# EAGLE design espduino-12-2 (EAGLE 7.2.0)
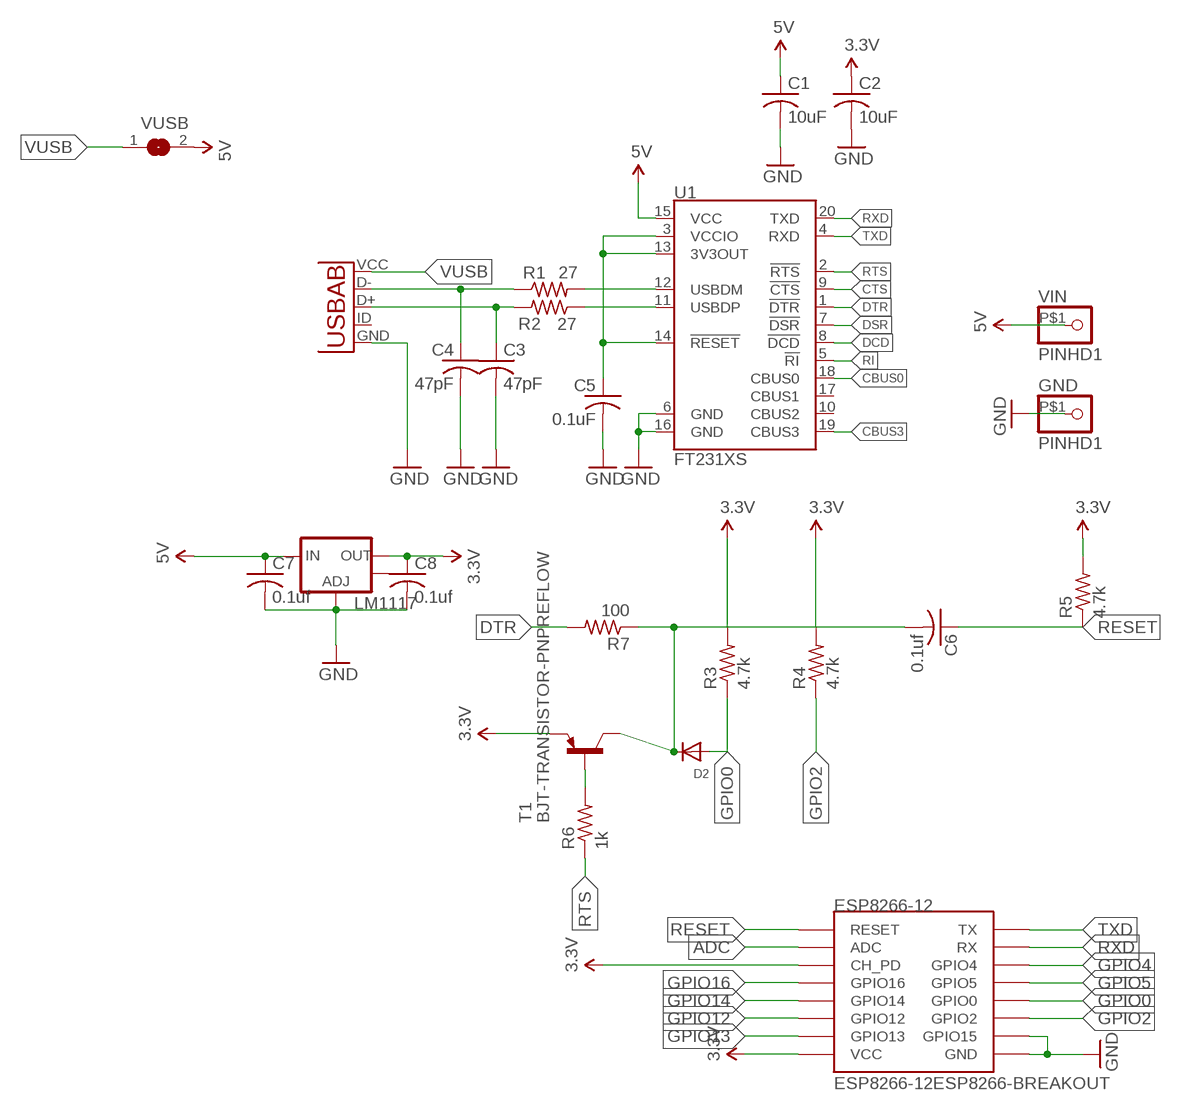
[diagram p0: schematic, sheet 1]

## Parts
C1  10uF  C-USC0603  [C0603]
C2  10uF  C-USC0603  [C0603]
C3  47pF  C-USC0603  [C0603]
C4  47pF  C-USC0603  [C0603]
C5  0.1uF  C-USC0603  [C0603]
C6  0.1uf  C-USC0603  [C0603]
C7  0.1uf  C-USC0603  [C0603]
C8  0.1uf  C-USC0603  [C0603]
D2  DIODESOT23_REFLOW  [SOT23-R]
ESP8266-12  ESP8266-12ESP8266-BREAKOUT  [ESP8266-12-EXT-HEADERS]
GND  PINHD1  [PINHD1]
LM1117  V_REG_LM1117SOT223  [SOT223]
R1  27  R-US_R0603  [R0603]
R2  27  R-US_R0603  [R0603]
R3  4.7k  R-US_R0603  [R0603]
R4  4.7k  R-US_R0603  [R0603]
R5  4.7k  R-US_R0603  [R0603]
R6  1k  R-US_R0603  [R0603]
R7  100  R-US_R0603  [R0603]
T1  BJT-TRANSISTOR-PNPREFLOW  [SOT23-R]
U1  FT231XS  [SSOP20_L]
U2  USB-AB  [MICRO-USB-A01SB141B1]
VIN  PINHD1  [PINHD1]
VUSB  SJCUTTABLE  [SJ-CUTTABLE]

## Nets
3.3V [POWER]: C2.1 C8.1 ESP8266-12.CH_PD ESP8266-12.VCC ESP8266-12.VCC_P(VCC) LM1117.2(OUT) R3.2 R4.2 R5.2 T1.2(E)
5V [POWER]: C1.1 C7.1 LM1117.3(IN) U1.15(VCC) VIN.P$1(GND) VUSB.2
ADC: ESP8266-12.ADC ESP8266-12.ADC_P(ADC)
CBUS0: U1.18(CBUS0)
CBUS3: U1.19(CBUS3)
CTS: U1.9(!CTS)
DCD: U1.8(!DCD)
DSR: U1.7(!DSR)
DTR: R7.2 U1.1(!DTR)
GND [POWER]: C1.2 C2.2 C3.2 C4.2 C5.2 C7.2 C8.2 ESP8266-12.GND ESP8266-12.GND_P(GND) ESP8266-12.GPIO15 GND.P$1(GND) LM1117.1(ADJ) U1.6(GND) U1.16(GND) U2.GND
GPIO0: D2.1(A) ESP8266-12.GPIO0 ESP8266-12.GPIO0_P(GPIO0) R3.1
GPIO2: ESP8266-12.GPIO2 ESP8266-12.GPIO2_P(GPIO2) R4.1
GPIO4: ESP8266-12.GPIO4 ESP8266-12.GPIO4_P(GPIO4)
GPIO5: ESP8266-12.GPIO5 ESP8266-12.GPIO5_P(GPIO5)
GPIO12: ESP8266-12.GPIO12 ESP8266-12.GPIO12_P(GPIO12)
GPIO13: ESP8266-12.GPIO13 ESP8266-12.GPIO13_P(GPIO13)
GPIO14: ESP8266-12.GPIO14 ESP8266-12.GPIO14_P(GPIO14)
GPIO16: ESP8266-12.GPIO16 ESP8266-12.GPIO_16_P(GPIO16)
N$1: R1.2 U1.12(USBDM)
N$2: R2.1 U1.11(USBDP)
N$3: C3.1 R2.2 U2.D+
N$4: C4.1 R1.1 U2.D-
N$5 [POWER]: C5.1 U1.3(VCCIO) U1.13(3V3OUT) U1.14(!RESET)
N$7: R6.2 T1.1(B)
NOT_DTR: C6.2 D2.3(C) R7.1 T1.3(C)
RESET: C6.1 ESP8266-12.RESET ESP8266-12.RST_P(RESET) R5.1
RI: U1.5(!RI)
RTS: R6.1 U1.2(!RTS)
RXD: ESP8266-12.RX ESP8266-12.RX_P(RX) U1.20(TXD)
TXD: ESP8266-12.TX ESP8266-12.TX_P(TX) U1.4(RXD)
VUSB [POWER]: U2.VCC(VBUS) VUSB.1
Unconnected: LM1117.4(OUT) U1.10(CBUS2) U1.17(CBUS1) U2.ID(USBID)

## Library data of the parts
C1-C8 = resistor:C-US: CAPACITOR, American symbol
D2 = adafruit:DIODE: Diode SMADIODE - SMA Surface Mount Package 20V 1A Schottky Diode Digikey: 641-1014-6-ND DO-1N4148 - Through Hole Small Current Diode SOD-123 20V 1 A (.5mV Vf) Schottky Diode - Digikey: MBRX120TPMSCT-ND SOD-323 10V 570mA (.38mV Vf, 3ns) Schottky Diode - Digikey: ZLLS410CT-ND SOD-523 30V 30mA Schottky Diode (RB751S-40TE61) - Digikey: RB751S-40TE61CT-ND SOT23-R/W - SOT23 Package (R = Solder Paste/Reflow Ovens, W = Hand-Soldering) BAT54Film 40V 300mA - Digikey: 497-7162-1-ND
ESP8266-12 = jumper-parts:ESP8266-12: ESP8266 Wifi module 12
GND VIN = jumper-parts:PINHD1
LM1117 = SparkFun-PowerIC:V_REG_LM1117: Voltage Regulator LM1117 Standard adjustable voltage regulator but in SMD form. Spark Fun Electronics SKU : COM-00595; PROD_ID: VREG-08170
R1-R7 = resistor:R-US_: RESISTOR, American symbol
T1 = jumper-parts:BJT-TRANSISTOR-PNP: PNP Darlington Transistor
U1 = SparkFun-DigitalIC:FT231X: FTDI FT231X Full Speed USB to Full-handshake UART This USB2.0 Full Speed IC offers a compact bridge to full handshake UART interfaces. The device is a UART, capable of operating up to 3MBaud, with low power consumption (8mA). The FT231X includes the complete FT-X series feature set and enables USB to be added into a system design quickly and easily over a UART interface.
U2 = jumper-parts:USB-AB: This is a USB AB connector that is compatible with USB OTG. i.e. this connector can serve as a host or device
VUSB = jumper-parts:SJ: SMD solder JUMPER

## Net classes
0 default: width 0.254 mm
1 POWER: width 0.406 mm

## Board
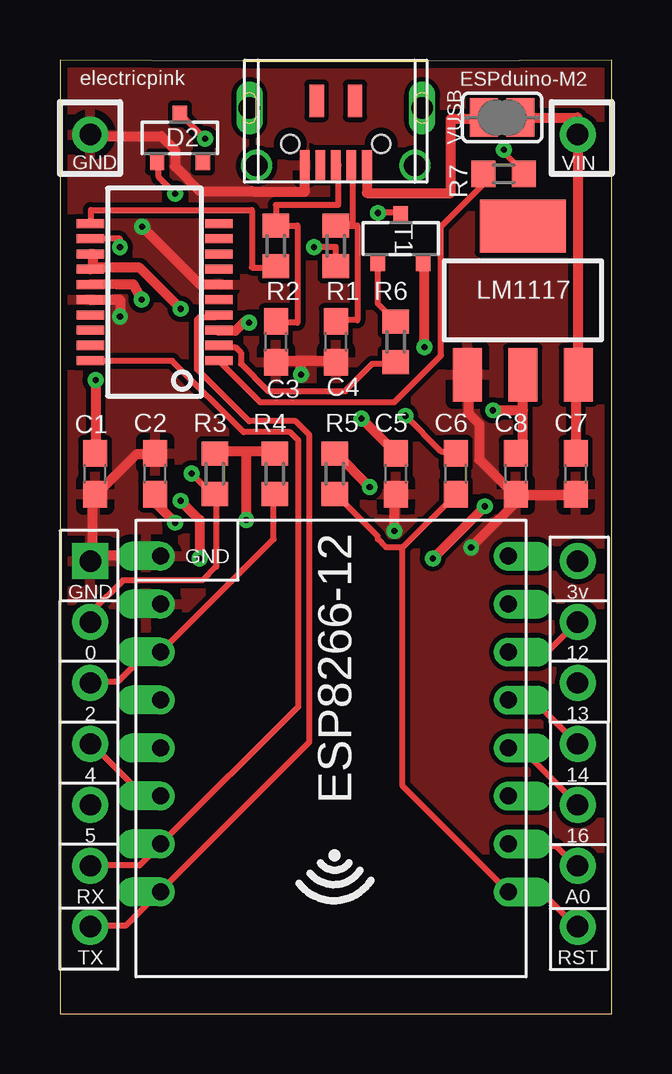
[diagram p1: board, top side]
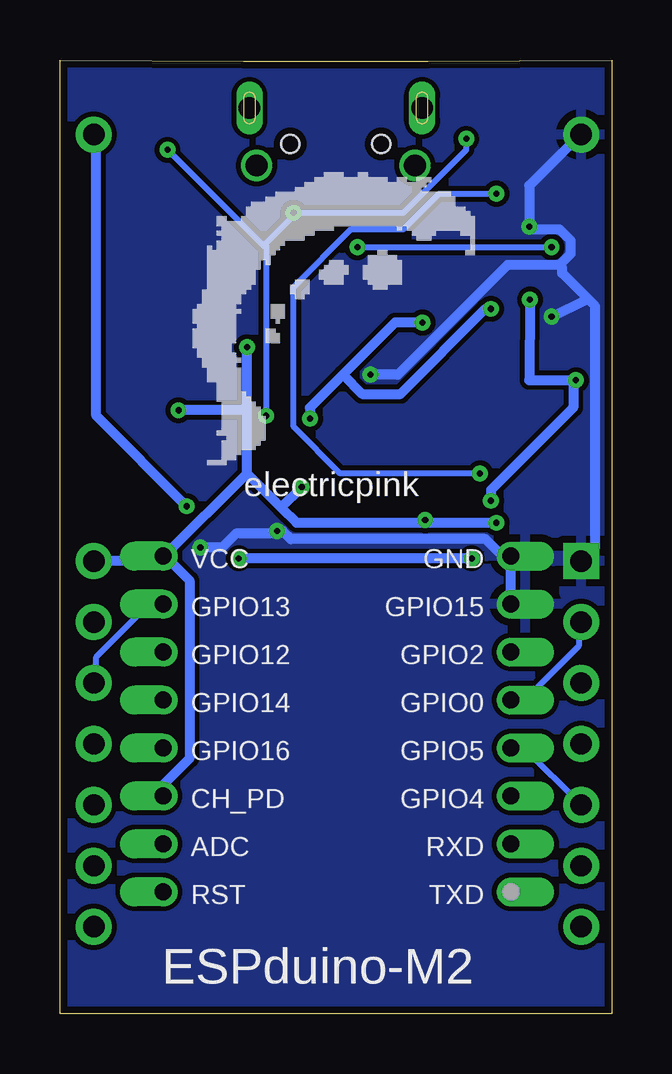
[diagram p2: board, bottom side, seen from below]

Size 23 x 39.75 mm. Coordinates in mm from the lower left corner, seen from the top.
Outline: 0,0 23,0 23,39.75 arc-1 0,39.75 0,0
Copper layers (1*16): Top 0.035mm / dielectric 1.5mm / Bottom 0.035mm
Design rules "SeeedStudio_2layer_conservative *": minimum track width 8mil, minimum drill 10mil, track to track 8mil, track to pad 8mil, pad to pad 8mil, via to via 8mil, smd to smd 0mil, copper to edge 12mil, drill to drill 12mil, minimum pad ring 0mil, minimum via ring 8mil, stop-mask expansion 2mil, vias tented up to drill 100mil, thermal gap 12mil

### Footprints (pad centres in the part's own frame; a part is rotated, then mirrored left to right if it is on the bottom)
C0603 = smd 1.1 x 1: 1 -0.85,0; 2 0.85,0
SOT23-R = smd 0.6 x 0.7: 1 -0.95,-1; 2 0.95,-1; 3 0,1
ESP8266-12-EXT-HEADERS = drill 0.711 pad 1.2 offset: ADC 2.895,11.791; CH_PD 2.895,9.791; GND 17.395,-0.209; GPIO0 17.395,5.791; GPIO2 17.395,3.791; GPIO4 17.395,9.791; GPIO5 17.395,7.791; GPIO12 2.895,3.791; GPIO13 2.895,1.791; GPIO14 2.895,5.791; GPIO15 17.395,1.791; GPIO16 2.895,7.791; RESET 2.895,13.791; RX 17.395,11.791; TX 17.395,13.791; VCC 2.895,-0.209 | drill 0.889 pad 1.5: ADC_P 0,12.7; GPIO0_P 20.32,2.54; GPIO2_P 20.32,5.08; GPIO4_P 20.32,7.62; GPIO5_P 20.32,10.16; GPIO12_P 0,2.54; GPIO13_P 0,5.08; GPIO14_P 0,7.62; GPIO_16_P 0,10.16; RST_P 0,15.24; RX_P 20.32,12.7; TX_P 20.32,15.24; VCC_P 0,0 | drill 0.889 pad 1.5 square: GND_P 20.32,0
PINHD1 = drill 0.889 pad 1.5: P$1 0,0
SOT223 = smd 1.219 x 2.235: 1 -2.311,-3.099; 2 0,-3.099; 3 2.311,-3.099 | smd 3.6 x 2.2: 4 0,3.099
R0603 = smd 1 x 1.1: 1 -0.85,0; 2 0.85,0
SSOP20_L = smd 0.381 x 1.143: 1 -2.857,-2.68; 2 -2.223,-2.68; 3 -1.587,-2.68; 4 -0.953,-2.68; 5 -0.318,-2.68; 6 0.318,-2.68; 7 0.953,-2.68; 8 1.587,-2.68; 9 2.223,-2.68; 10 2.857,-2.68; 11 2.857,2.68; 12 2.223,2.68; 13 1.587,2.68; 14 0.953,2.68; 15 0.318,2.68; 16 -0.318,2.68; 17 -0.953,2.68; 18 -1.587,2.68; 19 -2.223,2.68; 20 -2.857,2.68
MICRO-USB-A01SB141B1 = smd 0.4 x 1.25: D+ 0,-4.375; D- 0.65,-4.375; GND -1.3,-4.375; ID -0.65,-4.375; VCC 1.3,-4.375 | smd 0.6 x 1.35: P$1 -0.8,-1.7; P$2 0.8,-1.7 | drill 0.9 pad 1.3: P$8 -3.3,-4.4; P$9 3.3,-4.4 | drill 0.9 pad 1.1 long: P$10 -3.6,-2; P$12 3.6,-2 | hole 0.75: -1.9,-3.5; 1.9,-3.5
SJ-CUTTABLE = smd 1.168 x 1.6: 1 -0.762,0; 2 0.762,0

### Placement (x,y rotation side)
C1  1.46,22.5 270 top
C2  3.96,22.5 90 top
C3  9,28 270 top
C4  11.5,28 270 top
C5  14,22.5 270 top
C6  16.5,22.5 90 top
C7  21.5,22.5 270 top
C8  19,22.5 270 top
D2  5,36.5 0 top
ESP8266-12  21.59,18.86 180 top
GND  1.27,36.64 0 top
LM1117  19.3,29.73 0 top
R1  11.5,32 270 top
R2  9,32 90 top
R3  6.46,22.5 90 top
R4  8.96,22.5 90 top
R5  11.46,22.5 90 top
R6  14,28 90 top
R7  18.5,35 180 top
T1  14.2,32.3 0 top
U1  3.94,30.07 90 top
U2  11.5,39.75 0 top
U$2  [JUMPER-LOGO-X-SMALL]  12.7,31.3 0 top
VIN  21.59,36.64 0 top
VUSB  18.44,37.35 0 top

### Tracks (layer width: path | path; a pad name or v marks a point on that pad's centre or on a via)
3.3V  (via drill 0.25)
  Top 0.406: C8.1 19.3,23.35 19.3,25.15 | 19.3,25.15 LM1117.2 | 7.77,23.43 8.91,23.43 R4.2 | 7.77,23.43 6.51,23.43 R3.2 | v15.2,27.77 15.2,31.2 T1.2 | v4.8,20.46 4,21.26 4,21.6 C2.1 | v12.92,21.95 11.54,23.32 R5.2 | v7.77,20.57 7.77,23.43 | v18.06,25.15 19.3,25.15
  Bottom 0.406: 15.2,22.52 15.2,25.15 | 15.2,25.15 v15.2,27.77 | 15.2,22.52 18.63,19.09 ESP8266-12.VCC | 7.77,20.46 13.14,20.46 13.77,21.09 | 7.77,20.46 v4.8,20.46 | 15.2,22.52 13.77,21.09 | 13.77,21.09 v12.92,21.95 | v7.77,20.57 7.77,20.46 | ESP8266-12.CH_PD 18.63,9.14 18.63,9.6 17.6,10.63 17.6,18.06 18.52,18.97 ESP8266-12.VCC | ESP8266-12.VCC_P 21.49,18.86 18.97,18.86 18.86,18.97 ESP8266-12.VCC | 15.2,25.15 v18.06,25.15
5V  (via drill 0.25)
  Top 0.406: C7.1 21.5,26.63 LM1117.3 21.6,26.75 21.6,36.46 VIN.P$1 21.59,37.35 VUSB.2 | v1.49,26.4 1.49,23.43 C1.1 | v3.4,29.76 3.06,30.4 2.37,30.4 U1.15 | v15.54,18.97 v17.72,21.14 | v5.83,18.97 5.83,20.57 v5.03,21.37
  Bottom 0.406: v3.4,29.76 3.44,26.4 v1.49,26.4 1.6,26.29 1.6,25.26 5.03,21.83 v5.03,21.37 | v17.72,21.14 21.49,24.92 21.49,36.58 VIN.P$1 | v5.83,18.97 v15.54,18.97
ADC
  Top 0.254: ESP8266-12.ADC 18.75,6.97 20.69,6.97 21.49,6.17 ESP8266-12.ADC_P
DTR
  Top 0.254: R7.2 17.6,34.98 17.6,34.52 15.89,32.8 15.89,27.43 13.95,25.49 8.34,25.49 6.63,27.2 U1.1
GND  (via drill 0.25)
  Top 0.406: U2.GND 10.2,34.25 8.1,34.25 8,34.29 5.83,34.29 4.8,35.32 4.8,36.01 4.23,36.58 1.37,36.58 GND.P$1 | 10.06,27.2 11.43,27.2 C4.2 | 10.06,27.2 9.03,27.2 C3.2 | v3.43,32.8 5.83,30.4 6.51,30.4 U1.6 | v10.06,26.63 10.06,27.2 | C8.2 19.09,21.6 21.49,21.6 C7.2 | C8.2 18.86,21.72 17.49,23.09 17.49,24.57 17.03,25.03 17.03,26.52 LM1117.1 | C2.2 3.89,23.32 3.2,23.32 1.6,21.72 C1.2 1.37,21.6 1.37,18.86 ESP8266-12.GND_P 1.49,19.09 4.12,19.09 ESP8266-12.GND | v13.95,20.12 13.95,21.6 C5.2 | v17.14,19.43 18.97,21.26 18.97,21.49 C8.2 | U1.16 2.5,29.76 v2.5,29.05
  Bottom 0.406: GND.P$1 1.37,36.58 3.43,34.52 v3.43,32.8 3.31,32.69 2.17,32.69 1.71,32.23 1.71,31.66 2.17,31.2 | v10.06,26.63 8.91,26.63 4.34,31.2 2.17,31.2 | ESP8266-12.GPIO15 4.23,17.14 4.23,18.86 ESP8266-12.GND 4.23,19.09 4.57,19.09 5.26,19.77 13.37,19.77 13.72,20.12 v13.95,20.12 14.06,20 15.66,20 16.23,19.43 v17.14,19.43 | 1.1,29.9 0.69,29.49 0.69,19.43 1.26,18.86 ESP8266-12.GND_P | 1.1,29.9 2.06,30.86 2.06,31.09 2.17,31.2 | v2.5,29.05 1.1,29.75 1.1,29.9
  pour Top: 0,0 0,39.5 23,39.5 23,0
  pour Bottom: 0.5,39.5 23,39.5 23,0 0,0 0,39.5
GPIO0  (via drill 0.25)
  Top 0.254: v4.8,34.18 4.12,34.86 4.12,35.43 D2.1 | v5.49,22.52 6.4,21.6 R3.1 6.51,21.6 6.51,18.63 5.94,18.06 2.63,18.06 1.37,16.8 1.37,16.34 ESP8266-12.GPIO0_P
  Bottom 0.254: ESP8266-12.GPIO0 4.12,13.14 3.54,13.14 1.37,15.32 1.37,16.23 ESP8266-12.GPIO0_P | v4.8,34.18 7.2,34.18 8.69,32.69 10.86,32.69 13.26,30.29 13.26,24.46 11.32,22.52 v5.49,22.52
GPIO2
  Top 0.254: R4.1 8.91,21.6 8.91,19.77 4.23,15.09 ESP8266-12.GPIO2 4.12,14.97 3.54,14.97 2.4,13.83 1.37,13.83 ESP8266-12.GPIO2_P
GPIO4
  Top 0.254: ESP8266-12.GPIO4 4.12,9.14 3.43,9.14 1.37,11.2 ESP8266-12.GPIO4_P
GPIO5
  Bottom 0.254: ESP8266-12.GPIO5 4.12,10.97 3.54,10.97 1.37,8.8 ESP8266-12.GPIO5_P
GPIO12
  Top 0.254: ESP8266-12.GPIO12 18.75,15.09 20.34,15.09 21.49,16.23 ESP8266-12.GPIO12_P
GPIO13
  Bottom 0.254: ESP8266-12.GPIO13 18.75,17.03 19.32,17.03 21.49,14.86 21.49,13.83 ESP8266-12.GPIO13_P
GPIO14
  Top 0.254: ESP8266-12.GPIO14 18.75,13.03 19.77,13.03 21.49,11.32 ESP8266-12.GPIO14_P
GPIO16
  Top 0.254: ESP8266-12.GPIO16 18.75,10.97 19.32,10.97 21.49,8.8 ESP8266-12.GPIO_16_P
N$1  (via drill 0.25)
  Top 0.254: R1.2 11.5,31.95 v10.6,31.95 | v2.5,31.95 2.5,32.3 U1.12
  Top 0.305: U1.12
  Bottom 0.254: v10.6,31.95 v2.5,31.95
N$2
  Top 0.254: 1.3,32.93 1.3,33.5 8,33.5 8,31.1 9,31.1
  Top 0.305: U1.11 1.3,32.93 | 9,31.1 R2.1
N$3
  Top 0.254: 11.6,35.38 11.6,33.7 9,33.7 R2.2 9.9,32.85 9.9,28.8 9,28.8 C3.1
  Top 0.305: U2.D+ 11.6,35.38
N$4
  Top 0.254: 12.2,35.38 12.2,32.9 | R1.1 12.4,32.85 12.4,28.9 11.5,28.9 C4.1
  Top 0.305: U2.D- 12.2,35.38 | 12.2,32.9 11.5,32.9 R1.1
N$5  (via drill 0.25)
  Top 0.406: U1.13 1.37,31.66 1.37,31.09 U1.14 1.49,31.09 3.31,31.09 v5.03,29.38 | v12.57,24.8 13.95,23.43 C5.1 | v7.89,28.8 7.66,28.8 7.32,28.46 6.63,28.46 U1.3
  Bottom 0.406: v12.57,24.8 12.57,25.26 11.2,26.63 | 11.2,26.63 9.03,28.8 v7.89,28.8 | v5.03,29.38 5.26,29.38 8.8,25.83 10.4,25.83 11.2,26.63
N$7
  Top 0.254: T1.1 13.26,31.2 13.26,29.6 13.95,28.92 R6.2
NOT_DTR  (via drill 0.25)
  Top 0.254: v6.06,36.46 5.03,37.49 D2.3 | v13.26,33.38 14.17,33.38 T1.3 | v14.4,24.92 15.89,23.43 16.46,23.43 C6.2 | v18.52,36.01 18.52,35.89 19.32,35.09 R7.1
  Bottom 0.254: v6.06,36.46 6.06,36.01 8.69,33.38 v13.26,33.38 13.26,33.26 14.4,32.12 14.4,32 | 14.4,32 v14.4,24.92 | v18.52,36.01 14.52,32 14.4,32
RESET
  Top 0.254: 14.29,19.43 13.6,19.43 13.26,19.77 13.26,19.89 11.54,21.6 R5.1 | 14.29,19.43 16.46,21.6 C6.1 | ESP8266-12.RST_P 21.49,3.66 20.12,5.03 18.75,5.03 ESP8266-12.RESET 18.63,5.14 14.29,9.49 14.29,19.43
RTS
  Top 0.254: R6.1 13.95,27.09 13.03,27.09 11.89,25.95 8.69,25.95 7.54,27.09 7.54,27.55 7.32,27.77 6.63,27.77 U1.2
RXD
  Top 0.254: U1.20 1.37,27.2 4.69,27.2 7.66,24.23 9.6,24.23 9.94,23.89 9.94,12.8 4.23,7.09 ESP8266-12.RX 4.12,6.97 3.31,6.17 1.37,6.17 ESP8266-12.RX_P
TXD
  Top 0.254: U1.4 6.51,29.03 5.83,29.03 5.71,28.92 5.71,26.86 7.89,24.69 9.83,24.69 10.4,24.12 10.4,11.32 4.23,5.14 ESP8266-12.TX 4.12,5.03 2.74,3.66 1.37,3.66 ESP8266-12.TX_P
VUSB
  Top 0.406: U2.VCC 12.8,34.2 16.3,34.2 16.3,37.3 17.68,37.3 VUSB.1

### Text on the board
tNames: electricpink | ESPduino-M2 | GND | VIN
bNames: electricpink | ESPduino-M2